# EAGLE design Atmospheric (EAGLE 5.10)
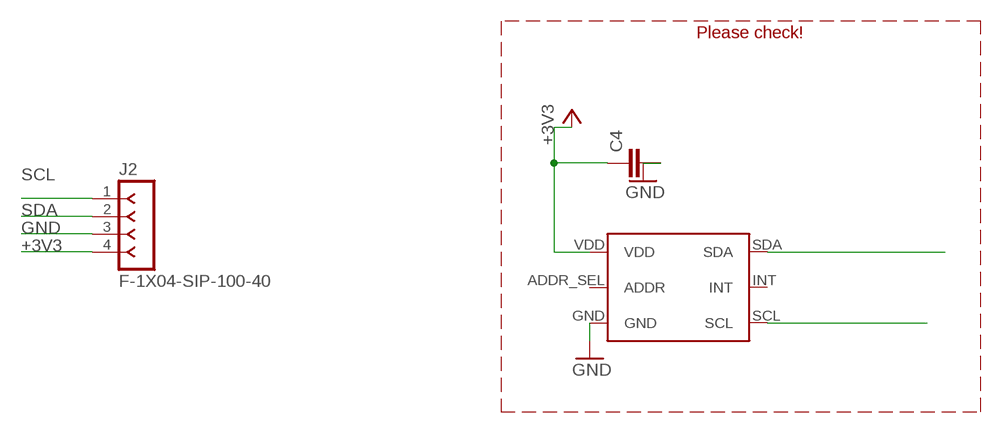
[diagram p0: schematic, sheet 1]

## Parts
C4  C-EU025-030X050  [C025-030X050]
J2  F-1X04-SIP-100-40  [SIP-100-04-40]
U$2  TSL2561T  [TSL2561T]

## Nets
+3V3: C4.1 J2.4 U$2.VDD
GND: C4.2 J2.3 U$2.GND
SCL: J2.1 U$2.SCL
SDA: J2.2 U$2.SDA
Unconnected: U$2.ADDR_SEL(ADDR) U$2.INT

## Notes on the sheet
- Please check!

## Library data of the parts
C4 = resistor:C-EU: CAPACITOR, European symbol
J2 = con-headers-jp:F-1X04-: FEMALE HEADER
U$2 = atmospheric:TSL2561T

## Board
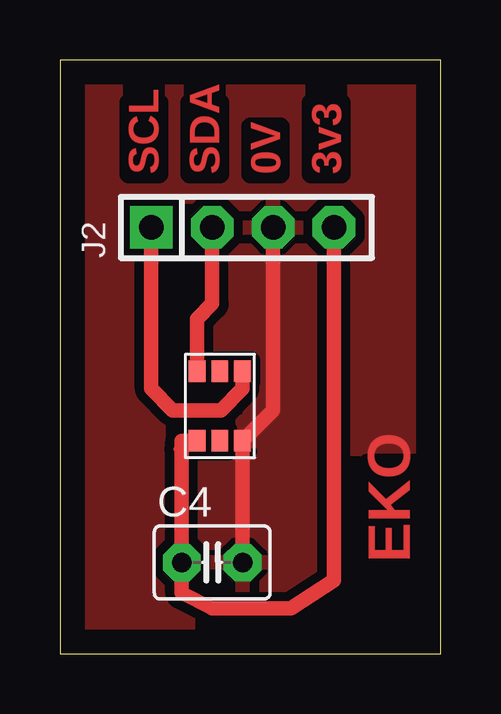
[diagram p1: board, top side]
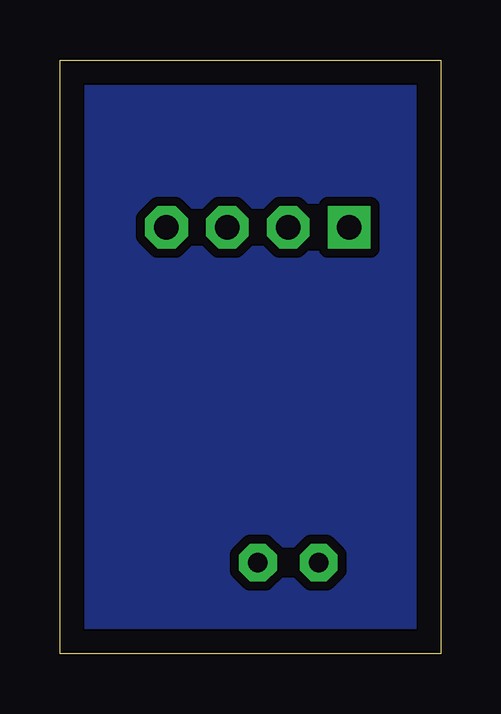
[diagram p2: board, bottom side, seen from below]

Size 15.88 x 24.77 mm. Coordinates in mm from the lower left corner, seen from the top.
Outline: 0,0 15.88,0 15.88,24.77 0,24.77 0,0
Copper layers (1*16): Top 0.035mm / dielectric 1.5mm / Bottom 0.035mm
Design rules "default *": minimum track width 15mil, minimum drill 24mil, track to track 15mil, track to pad 15mil, pad to pad 15mil, via to via 15mil, smd to smd 8mil, copper to edge 40mil, drill to drill 8mil, minimum pad ring 15mil, minimum via ring 8mil, stop-mask expansion 4mil, vias tented up to drill 0mil, thermal gap 10mil

### Footprints (pad centres in the part's own frame; a part is rotated, then mirrored left to right if it is on the bottom)
C025-030X050 = drill 0.813 octagon: 1 -1.27,0; 2 1.27,0
SIP-100-04-40 = drill 1.016 pad 1.778 square: 1 -3.81,0 | drill 1.016 pad 1.778 octagon: 2 -1.27,0; 3 1.27,0; 4 3.81,0
TSL2561T = smd 0.9 x 0.7: ADDR_SEL 0,0.95; GND 0,0; INT 2.9,0.95; SCL 2.9,0; SDA 2.9,1.9; VDD 0,1.9

### Placement (x,y rotation side)
C4  6.35,3.81 0 top
J2  7.62,17.78 0 top
U$2  7.62,8.89 90 top

### Tracks (layer width: path | path; a pad name or v marks a point on that pad's centre or on a via)
+3V3
  Top 0.61: U$2.VDD 5.08,8.89 C4.1 5.08,2.54 6.35,1.91 9.63,1.91 11.43,3.07 J2.4
GND
  Top 0.61: C4.2 U$2.GND 8.89,10.16 J2.3
  pour Top: 0,24.13 15.24,24.13 15.24,0 0,0
N$1
  pour Bottom: 0,24.13 15.24,24.13 15.24,0 0,0
SCL
  Top 0.61: U$2.SCL 7.62,11.06 6.72,10.16 4.71,10.16 3.81,11.06 J2.1
SDA
  Top 0.61: U$2.SDA 5.71,13.97 6.35,14.61 J2.2

### Text on the board
Top: SCL | SDA | 0V | 3v3 | EKO